# Altium schematic sheet Power_Schematic.SchDoc
size A
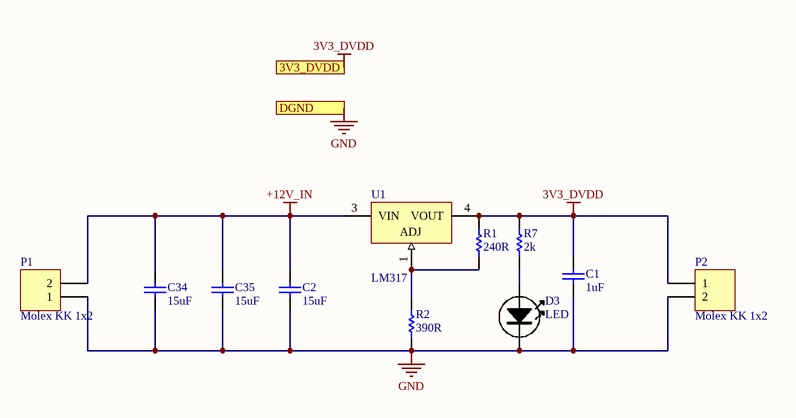
[diagram p0: Power_Schematic.SchDoc]

## Parts
C1  1uF  [C0805]
C2  15uF  [C0805]
C34  15uF  [C0805]
C35  15uF  [C0805]
D3  LED  [0805LED]
P1  Molex KK 1x2  [Molex KK 2x1]
P2  Molex KK 1x2  [Molex KK 2x1]
R1  240R  [R0805]
R2  390R  [R0805]
R7  2k  [R0805]
U1  LM317  [D-PAK]

## Ports
3V3_DVDD, DGND

## Nets
3V3_DVDD: C1.1 P2.1 R1.2 R7.2 U1.4(VOUT) ; port 3V3_DVDD
+12V_IN: C2.1 C34.1 C35.1 P1.2 U1.3(VIN)
GND: C1.2 C2.2 C34.2 C35.2 D3.K P1.1 P2.2 R2.1 ; port DGND
NetD3_A: D3.A R7.1
NetR1_1: R1.1 R2.2 U1.1(ADJ)

## Library data of the parts
C1 C2 C34 C35 = C0805: 0805 Capacitor
  C1: Value: 1uF
  C2 C34 C35: Value: 15uF
D3 = LED: Manufacturer: OSRAM Opto Semiconductors Inc; Manufacturer Part Number: LS T676-Q1R2-1-Z; Reel: D13
P1 P2 = Molex KK 1x2: 1x2 Molex KK Connector
R1 R2 R7 = R0805: RESISTOR 0805
  R1: Value: 240R
  R2: Value: 390R
  R7: Value: 2k
U1 = LM317: Linear Voltage Regulator